# EAGLE schematic agatbreadboardshort (EAGLE 7.5.0)
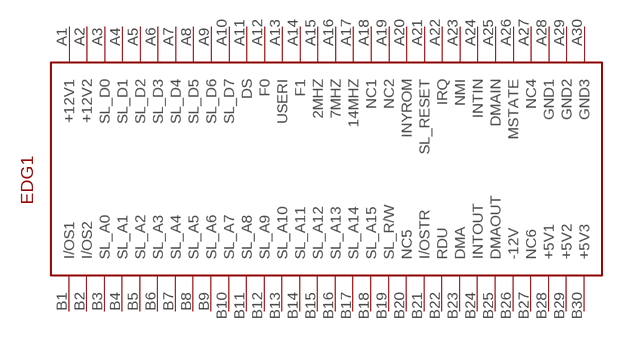
[diagram p0: schematic, sheet 1]

## Parts
EDG1  AGAT_CON  [AGAT_CONP]
Unconnected: EDG1.A1(+12V1) EDG1.A2(+12V2) EDG1.A3(SL_D0) EDG1.A4(SL_D1) EDG1.A5(SL_D2) EDG1.A6(SL_D3) EDG1.A7(SL_D4) EDG1.A8(SL_D5) EDG1.A9(SL_D6) EDG1.A10(SL_D7) EDG1.A11(DS) EDG1.A12(F0) EDG1.A13(USERI) EDG1.A14(F1) EDG1.A15(2MHZ) EDG1.A16(7MHZ) EDG1.A17(14MHZ) EDG1.A18(NC1) EDG1.A19(NC2) EDG1.A20(INYROM) EDG1.A21(SL_RESET) EDG1.A22(IRQ) EDG1.A23(NMI) EDG1.A24(INTIN) EDG1.A25(DMAIN) EDG1.A26(MSTATE) EDG1.A27(NC4) EDG1.A28(GND1) EDG1.A29(GND2) EDG1.A30(GND3) EDG1.B1(I/OS1) EDG1.B2(I/OS2) EDG1.B3(SL_A0) EDG1.B4(SL_A1) EDG1.B5(SL_A2) EDG1.B6(SL_A3) EDG1.B7(SL_A4) EDG1.B8(SL_A5) EDG1.B9(SL_A6) EDG1.B10(SL_A7) EDG1.B11(SL_A8) EDG1.B12(SL_A9) EDG1.B13(SL_A10) EDG1.B14(SL_A11) EDG1.B15(SL_A12) EDG1.B16(SL_A13) EDG1.B17(SL_A14) EDG1.B18(SL_A15) EDG1.B19(SL_R/W) EDG1.B20(NC5) EDG1.B21(I/OSTR) EDG1.B22(RDU) EDG1.B23(DMA) EDG1.B24(INTOUT) EDG1.B25(DMAOUT) EDG1.B26(-12V) EDG1.B27(NC6) EDG1.B28(+5V1) EDG1.B29(+5V2) EDG1.B30(+5V3)

## Library data of the parts
EDG1 = AGAT_Slot_Connector:AGAT_CON